# EasyEDA Pro project USB_HUB_EASYEDA.epro

# Schematic Schematic1
Board Name: Board1; Create Date: 2026-07-30; Page Name: P1; Project Name: USB HUB; Schematic Name: Schematic1; Update Date: 2026-07-30; Company: EasyEDA.com; Page Size: A4; Version: V1.0
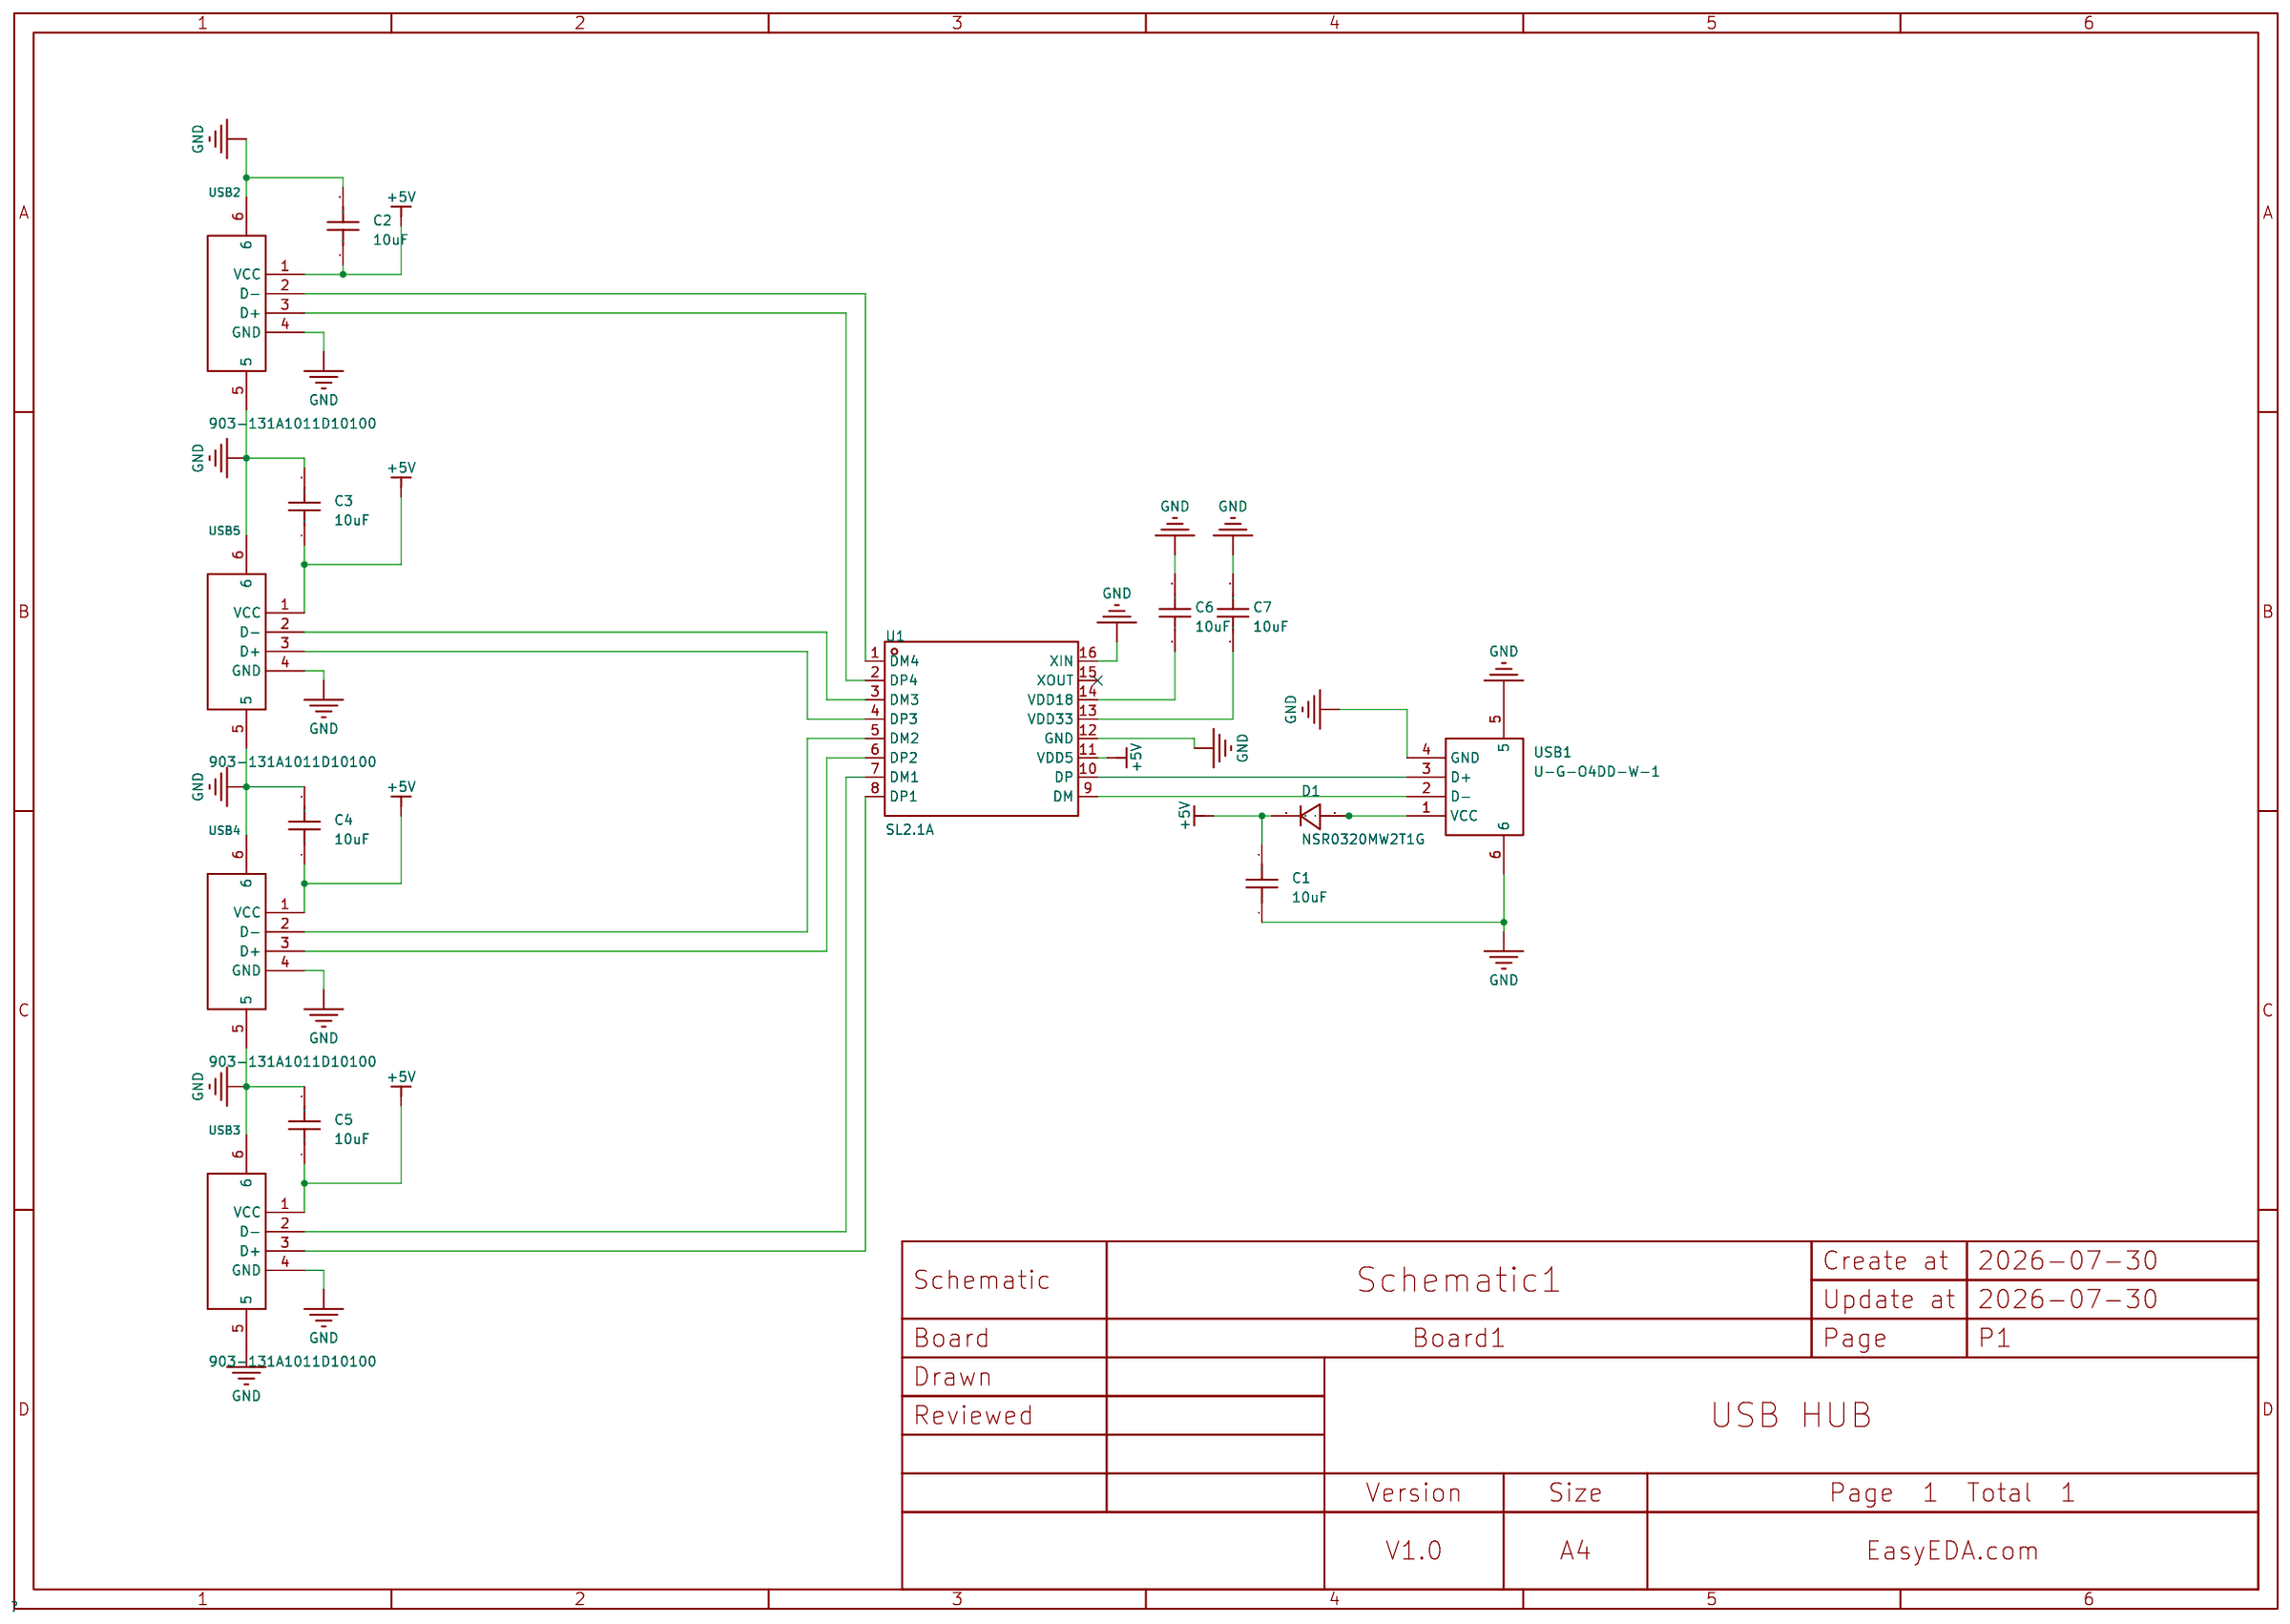
[diagram p0: schematic sheet]

## Parts
C1  10uF  [C0603]
C2  10uF  [C0603]
C3  10uF  [C0603]
C4  10uF  [C0603]
C5  10uF  [C0603]
C6  10uF  [C0603]
C7  10uF  [C0603]
D1  NSR0320MW2T1G  [SOD-323_L1.8-W1.3-LS2.5-RD]
U1  SL2.1A  [SOP-16_L10.0-W3.9-P1.27-LS6.0-BL]
USB1  U-G-O4DD-W-1  [USB-A-TH_U-G-04WD-W-01]
USB2  903-131A1011D10100  [USB-A-TH_C46407]
USB3  903-131A1011D10100  [USB-A-TH_C46407]
USB4  903-131A1011D10100  [USB-A-TH_C46407]
USB5  903-131A1011D10100  [USB-A-TH_C46407]

## Library data of the parts
C1-C7 = CL10A106KP8NNNC: Capacitance:10uF Tolerance:±10% Tolerance:±10% Voltage Rating:10V Temperature Coefficient:X5R; LCSC Part Name: 10uF ±10% 10V; Supplier Part: C19702; Manufacturer: SAMSUNG(三星); Supplier Footprint: 0603; JLCPCB Part Class: Basic Part; Datasheet: https://item.szlcsc.com/datasheet/CL10A106KP8NNNC/20411.html; Supplier: LCSC; Tolerance: ±10%; Voltage Rating: 10V; Temperature Coefficient: X5R
D1 = NSR0320MW2T1G: Voltage - Forward(Vf@If):500mV@900mA Voltage - DC Reverse(Vr):20V Current - Rectified:1A Reverse Leakage Current (Ir):50uA@15V Operating Junction Temperature Range:-55℃~+125℃ Operating Junction Temperature Range:-55℃~+125℃ Non-Repetitive Peak Forward Surg; LCSC Part Name: 电压:20V 电流:1A; Supplier Part: C48192; Manufacturer: onsemi(安森美); Supplier Footprint: SOD-323; JLCPCB Part Class: Extended Part; Datasheet: https://item.szlcsc.com/datasheet/NSR0320MW2T1G/49199.html; Supplier: LCSC; Voltage - Forward(Vf@If): 500mV@900mA; Voltage - DC Reverse(Vr): 20V; Current - Rectified: 1A; Reverse Leakage Current (Ir): 50uA@15V; Operating Junction Temperature Range: -55℃~+125℃; Non-Repetitive Peak Forward Surge Current: 5A
U1 = SL2.1A: type:Hub USB Protocol:USB 2.0 Voltage - Supply:4V~5.25V Voltage - Supply:4V~5.25V Operating Temperature:0℃~+70℃ Operating Temperature:0℃~+70℃ Current - Supply:120mA Quiescent Supply Current:2.5mA Number of Channels:4 Features:Internal regulator；ESD protec; LCSC Part Name: USB2.0高速4端口HUB控制器 停产; Supplier Part: C192893; Manufacturer: CoreChips(和芯润德); Supplier Footprint: SOP-16; JLCPCB Part Class: Extended Part; Datasheet: https://item.szlcsc.com/datasheet/SL2.1A/225853.html; Supplier: LCSC; type: Hub; USB Protocol: USB 2.0; Voltage - Supply: 4V~5.25V; Operating Temperature: 0℃~+70℃; Current - Supply: 120mA; Quiescent Supply Current: 2.5mA; Number of Channels: 4; Features: Internal regulator；ESD protection；Low-power mode；Power-on reset；BC1.2 protocol support
USB1 = U-G-O4DD-W-1: Connector Type:Type-A Protocol Standard:USB 2.0 Gender:Male Mounting Type:Laminated board Number of Contacts:4P Number of Ports:1 Current Rating-Power:1A Voltage Rating:30V Length:18.75mm Detection color:Black; LCSC Part Name: Type-A 公 沉板; Supplier Part: C98125; Manufacturer: 韩国韩荣; Supplier Footprint: 插件; JLCPCB Part Class: Extended Part; Datasheet: https://item.szlcsc.com/datasheet/U-G-O4DD-W-1/99334.html; Supplier: LCSC; Connector Type: Type-A; Protocol Standard: USB 2.0; Gender: Male; Mounting Type: Laminated board; Number of Contacts: 4P; Number of Ports: 1; Current Rating-Power: 1A; Voltage Rating: 30V; Length: 18.75mm; Detection color: Black
USB2-USB5 = 903-131A1011D10100: Connector Type:Type-A Protocol Standard:USB 2.0 Gender:Female Mounting Type:Right Angle Number of Contacts:4P Number of Ports:1 Current Rating-Power:1.5A Voltage Rating:30V Length:13.6mm Detection color:White Operating Temperature:-35℃~+85℃ Operating Temp; LCSC Part Name: Type-A 母 弯插; Supplier Part: C46407; Manufacturer: 精拓金; Supplier Footprint: 插件; JLCPCB Part Class: Extended Part; Datasheet: https://item.szlcsc.com/datasheet/903-131A1011D10100/47411.html; Supplier: LCSC; Connector Type: Type-A; Protocol Standard: USB 2.0; Gender: Female; Mounting Type: Right Angle; Number of Contacts: 4P; Number of Ports: 1; Current Rating-Power: 1.5A; Voltage Rating: 30V; Length: 13.6mm; Detection color: White; Operating Temperature: -35℃~+85℃

## Nets
+5V: C1.2 C2.1 C3.1 C4.1 C5.1 D1.1(C) U1.11(VDD5) USB2.1(VCC) USB3.1(VCC) USB4.1(VCC) USB5.1(VCC)
GND: C1.1 C2.2 C3.2 C4.2 C5.2 C6.2 C7.2 U1.12(GND) U1.16(XIN) USB1.4(GND) USB1.5 USB1.6 USB2.4(GND) USB2.5 USB2.6 USB3.4(GND) USB3.5 USB3.6 USB4.4(GND) USB4.5 USB4.6 USB5.4(GND) USB5.5 USB5.6
$1N25: U1.1(DM4) USB2.2(D-)
$1N26: U1.2(DP4) USB2.3(D+)
$1N27: U1.3(DM3) USB5.2(D-)
$1N28: U1.4(DP3) USB5.3(D+)
$1N29: U1.5(DM2) USB4.2(D-)
$1N30: U1.6(DP2) USB4.3(D+)
$1N31: U1.7(DM1) USB3.2(D-)
$1N32: U1.8(DP1) USB3.3(D+)
$1N33: U1.10(DP) USB1.3(D+)
$1N34: U1.9(DM) USB1.2(D-)
$1N37: D1.2(A) USB1.1(VCC)
$1N59: C6.1 U1.14(VDD18)
$1N61: C7.1 U1.13(VDD33)

Not connected (* = marked no-connect by the designer): U1 15(XOUT)*

# Board PCB1
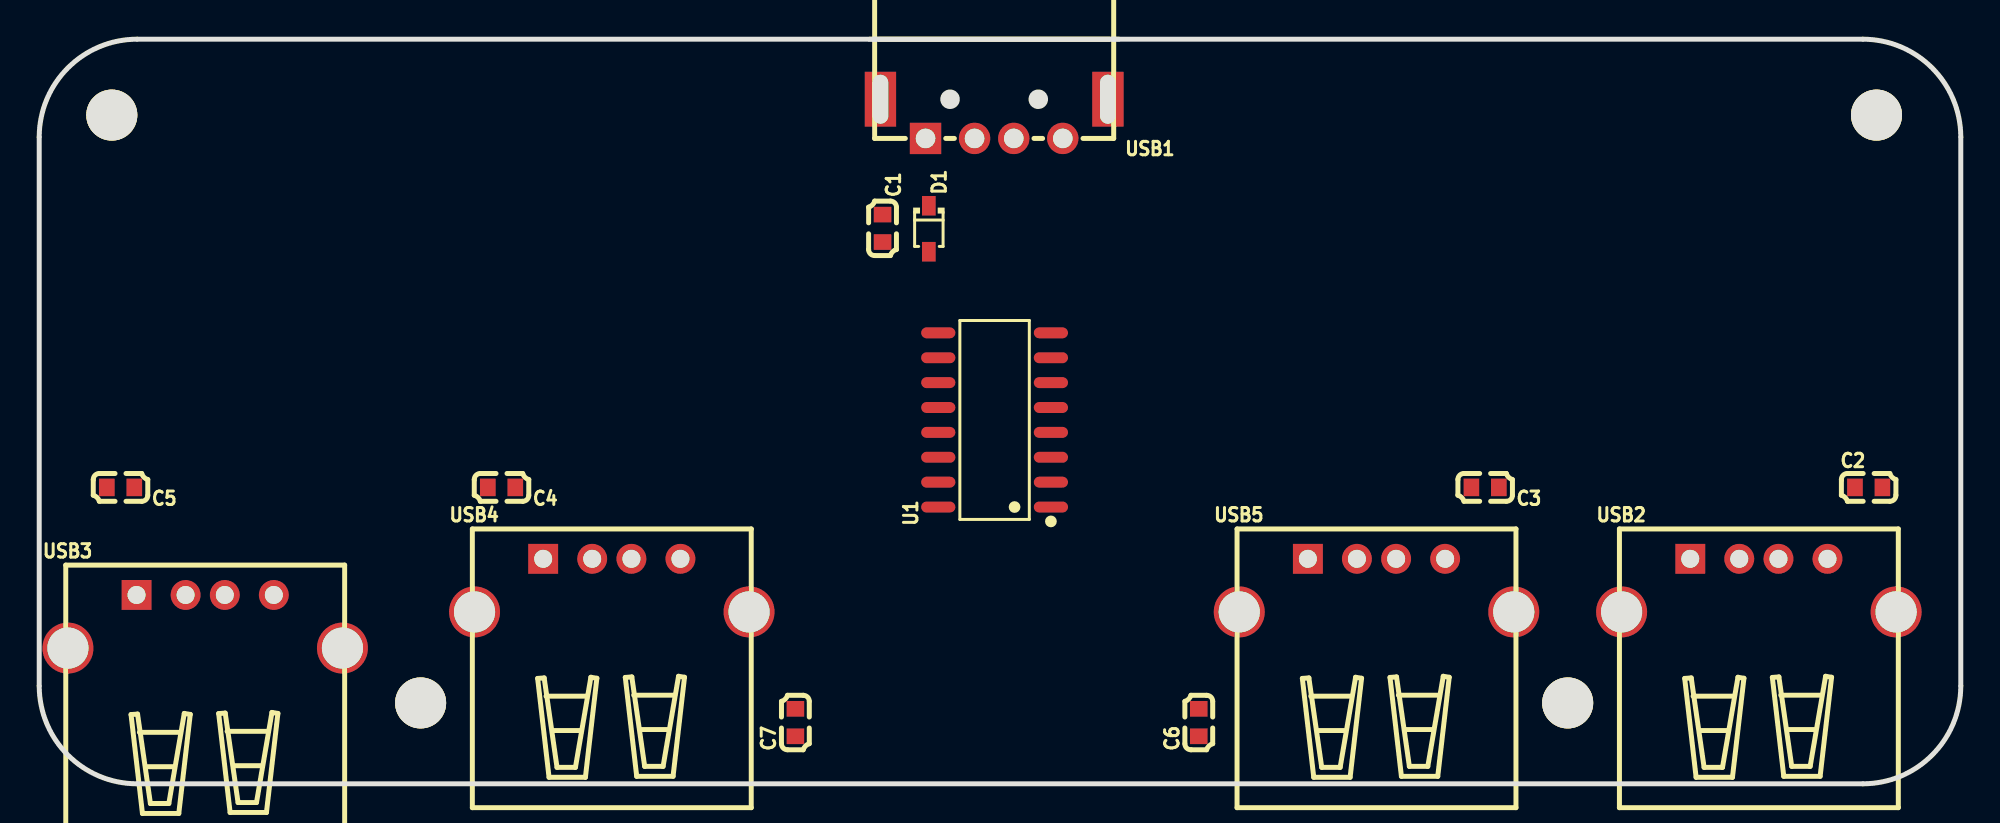
[diagram p1: board, top side]
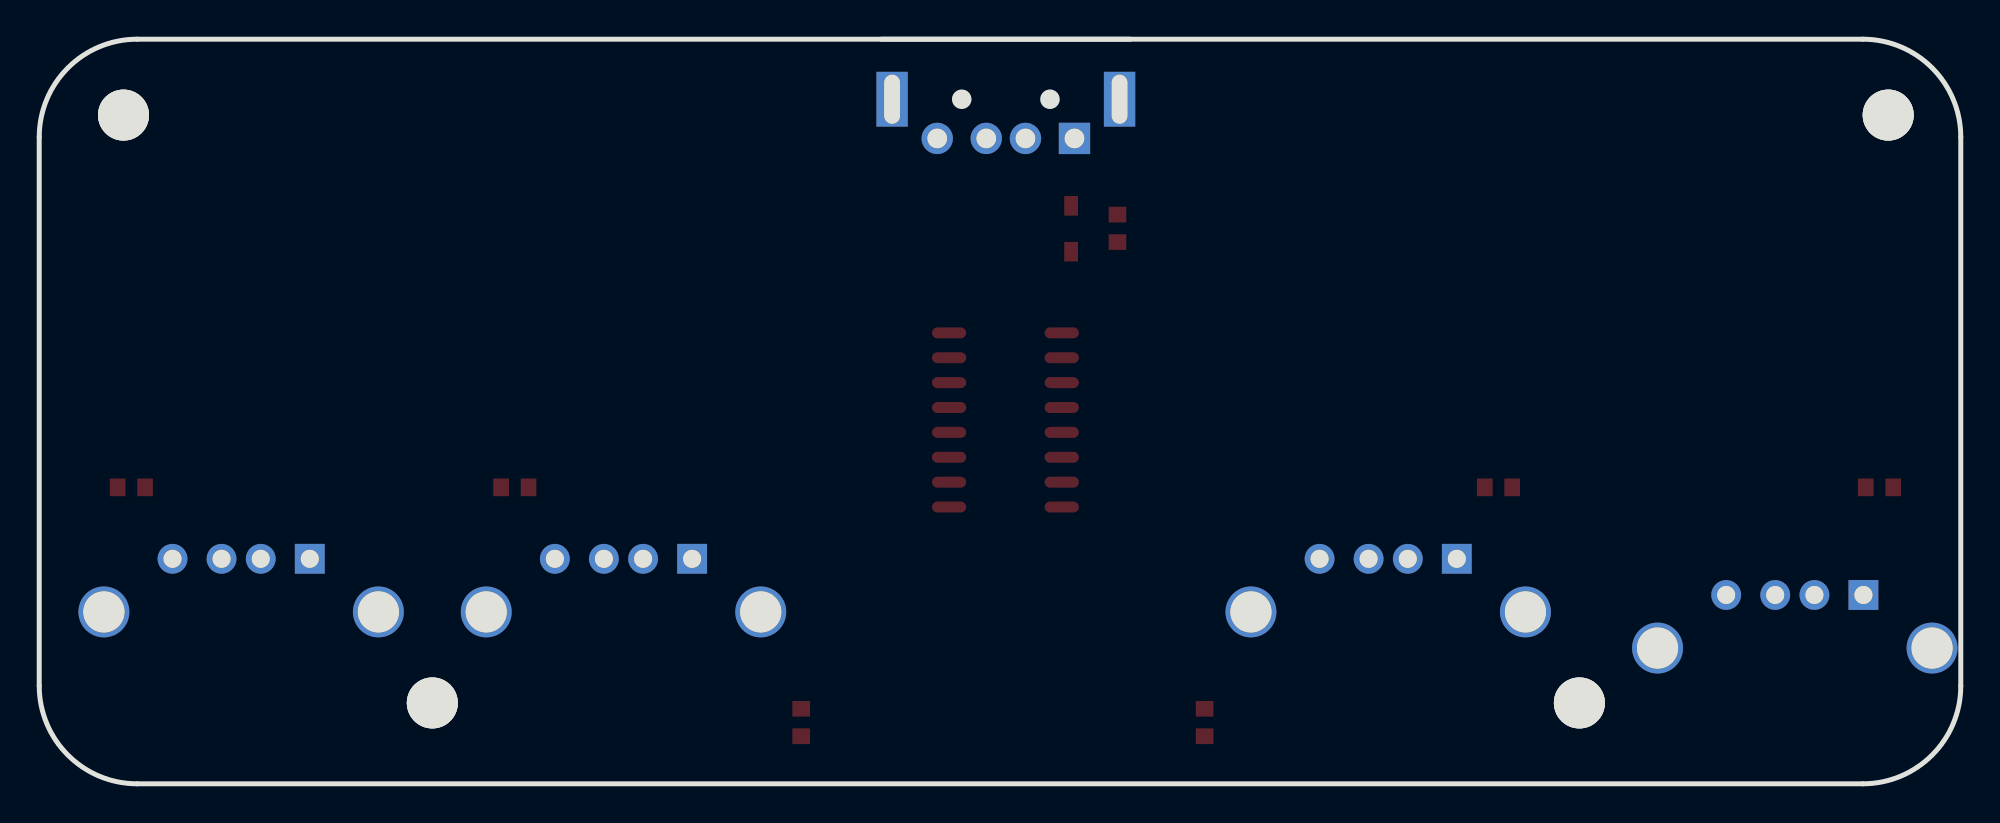
[diagram p2: board, bottom side, seen from below]

Outline 98 x 38 mm; copper layers: Top Layer, Bottom Layer. Coordinates in mm from the lower left corner of the outline.
Outline path: 0,33 0,5 arc(1.46,1.46) 5,0 93,0 arc(96.54,1.46) 98,5 98,33 arc(96.54,36.54) 93,38 5,38 arc(1.46,36.54) 0,33
Stack: Top Layer 0.035mm / Dielectric1 1.51mm FR4 er 4.5 / Bottom Layer 0.035mm

## Design rules (mm)
net $1N25: DP1
net $1N26: DP1
net $1N27: DP2
net $1N28: DP2
net $1N29: DP3
net $1N30: DP3
net $1N31: DP4
net $1N32: DP4
spacing copperThickness1oz (default): track to track 0.102, other pairs 0.152 to 0.3
spacing copperThickness2oz: track to track 0.203, other pairs 0.152 to 0.3
track width copperThickness1oz (default): min 0.127, default 0.254, max 2.54
track width copperThickness2oz: min 0.203, default 0.254, max 2.54
differential pair differentialPair (default): width min 0.127, default 0.254, max 2.54; gap min 0.152, default 0.152

## Placement (name value [footprint] x y rotation side)
C1  10uF  [C0603]  43.01 28.35 270 top
C2  10uF  [C0603]  93.3 15.13 0 top
C3  10uF  [C0603]  73.74 15.13 180 top
C4  10uF  [C0603]  23.58 15.13 180 top
C5  10uF  [C0603]  4.15 15.13 180 top
C6  10uF  [C0603]  59.14 3.13 90 top
C7  10uF  [C0603]  38.56 3.13 90 top
D1  NSR0320MW2T1G  [SOD-323_L1.8-W1.3-LS2.5-RD]  45.37 28.33 270 top
NOREF  -  [Pad_e61]  3.7 34.13 0 top
NOREF#2  -  [Pad_e64]  19.45 4.13 0 top
NOREF#3  -  [Pad_e63]  77.95 4.13 0 top
NOREF#4  -  [Pad_e62]  93.7 34.13 0 top
U1  SL2.1A  [SOP-16_L10.0-W3.9-P1.27-LS6.0-BL]  48.72 18.57 90 top
USB1  U-G-O4DD-W-1  [USB-A-TH_U-G-04WD-W-01]  48.7 33.94 180 top
USB2  903-131A1011D10100  [USB-A-TH_C46407]  87.7 10.13 0 top
USB3  903-131A1011D10100  [USB-A-TH_C46407]  8.47 8.28 0 top
USB4  903-131A1011D10100  [USB-A-TH_C46407]  29.2 10.13 0 top
USB5  903-131A1011D10100  [USB-A-TH_C46407]  68.2 10.13 0 top

## Footprints (pads in the part's own frame, mm; a bottom-side part is the same pattern mirrored in y, then rotated)
C0603
  rect 0.8x0.9 smd: 1(-0.7,0) 2(0.7,0)
Pad_e61
  round 2.6 hole 2.6: (0,0)
Pad_e62
  round 2.6 hole 2.6: (0,0)
Pad_e63
  round 2.6 hole 2.6: (0,0)
Pad_e64
  round 2.6 hole 2.6: (0,0)
SOD-323_L1.8-W1.3-LS2.5-RD
  rect 1x0.7 smd: 1(-1.173,0) 2(1.173,0)
SOP-16_L10.0-W3.9-P1.27-LS6.0-BL
  oval 0.56x1.745 smd: 1(-4.445,-2.873) 2(-3.175,-2.873) 3(-1.905,-2.873) 4(-0.635,-2.873) 5(0.635,-2.873) 6(1.905,-2.873) 7(3.175,-2.873) 8(4.445,-2.873) 9(4.445,2.873) 10(3.175,2.873) 11(1.905,2.873) 12(0.635,2.873) 13(-0.635,2.873) 14(-1.905,2.873) 15(-3.175,2.873) 16(-4.445,2.873)
USB-A-TH_C46407
  rect 1.524x1.524 hole 0.92: 1(-3.5,1.355)
  round 1.524 hole 0.92: 2(-1,1.355) 3(1,1.355) 4(3.5,1.355)
  round 2.6 hole 2.1: 5(7,-1.355) 6(-7,-1.355)
USB-A-TH_U-G-04WD-W-01
  rect 1.6x1.6 hole 1: 1(3.5,1)
  round 1.6 hole 1: 2(1,1) 3(-1,1) 4(-3.5,1)
  rect 1.6x2.8 hole 0.8x2.5: 5(5.8,-1) 6(-5.8,-1)

## Nets
As in the schematic.

Pads without a net: U1 15

## Text on the board
Top Silkscreen Layer: Warranty status: successfully voided. | ARSUKIE
